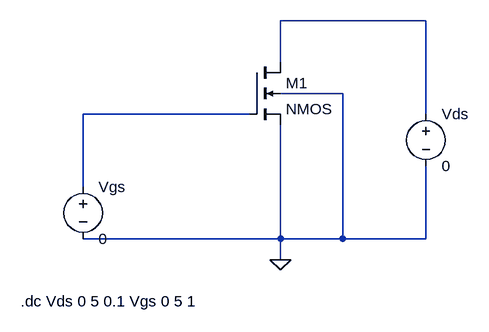
[diagram p0: schematic IDvsVGS.asc]
IDvsVGS.asc, the LTspice schematic file:
Version 4.1
SHEET 1 880 680
WIRE 448 48 224 48
WIRE 224 112 224 48
WIRE 320 160 224 160
WIRE 176 192 -80 192
WIRE 448 192 448 48
WIRE -80 304 -80 192
WIRE 224 384 224 208
WIRE 224 384 -80 384
WIRE 320 384 320 160
WIRE 320 384 224 384
WIRE 448 384 448 272
WIRE 448 384 320 384
WIRE 224 416 224 384
FLAG 224 416 0
SYMBOL nmos4 176 112 R0
SYMATTR InstName M1
SYMATTR Value2 l=20u w=100u
SYMBOL voltage 448 176 R0
SYMATTR InstName Vds
SYMATTR Value 0
SYMBOL voltage -80 288 R0
SYMATTR InstName Vgs
SYMATTR Value 0
TEXT -176 480 Left 2 !.dc Vds 0 5 0.1 Vgs 0 5 1

The netlist it stands for:
* IDvsVGS.asc
M1 N001 N002 0 0 NMOS l=20u w=100u
Vds N001 0 0
Vgs N002 0 0
.model NMOS NMOS
.model PMOS PMOS
.lib standard.mos
.dc Vds 0 5 0.1 Vgs 0 5 1
.backanno
.end